# Altium schematic sheet EE209_Schematic.SchDoc
size A4; SheetNumber: 1; SheetTotal: 1
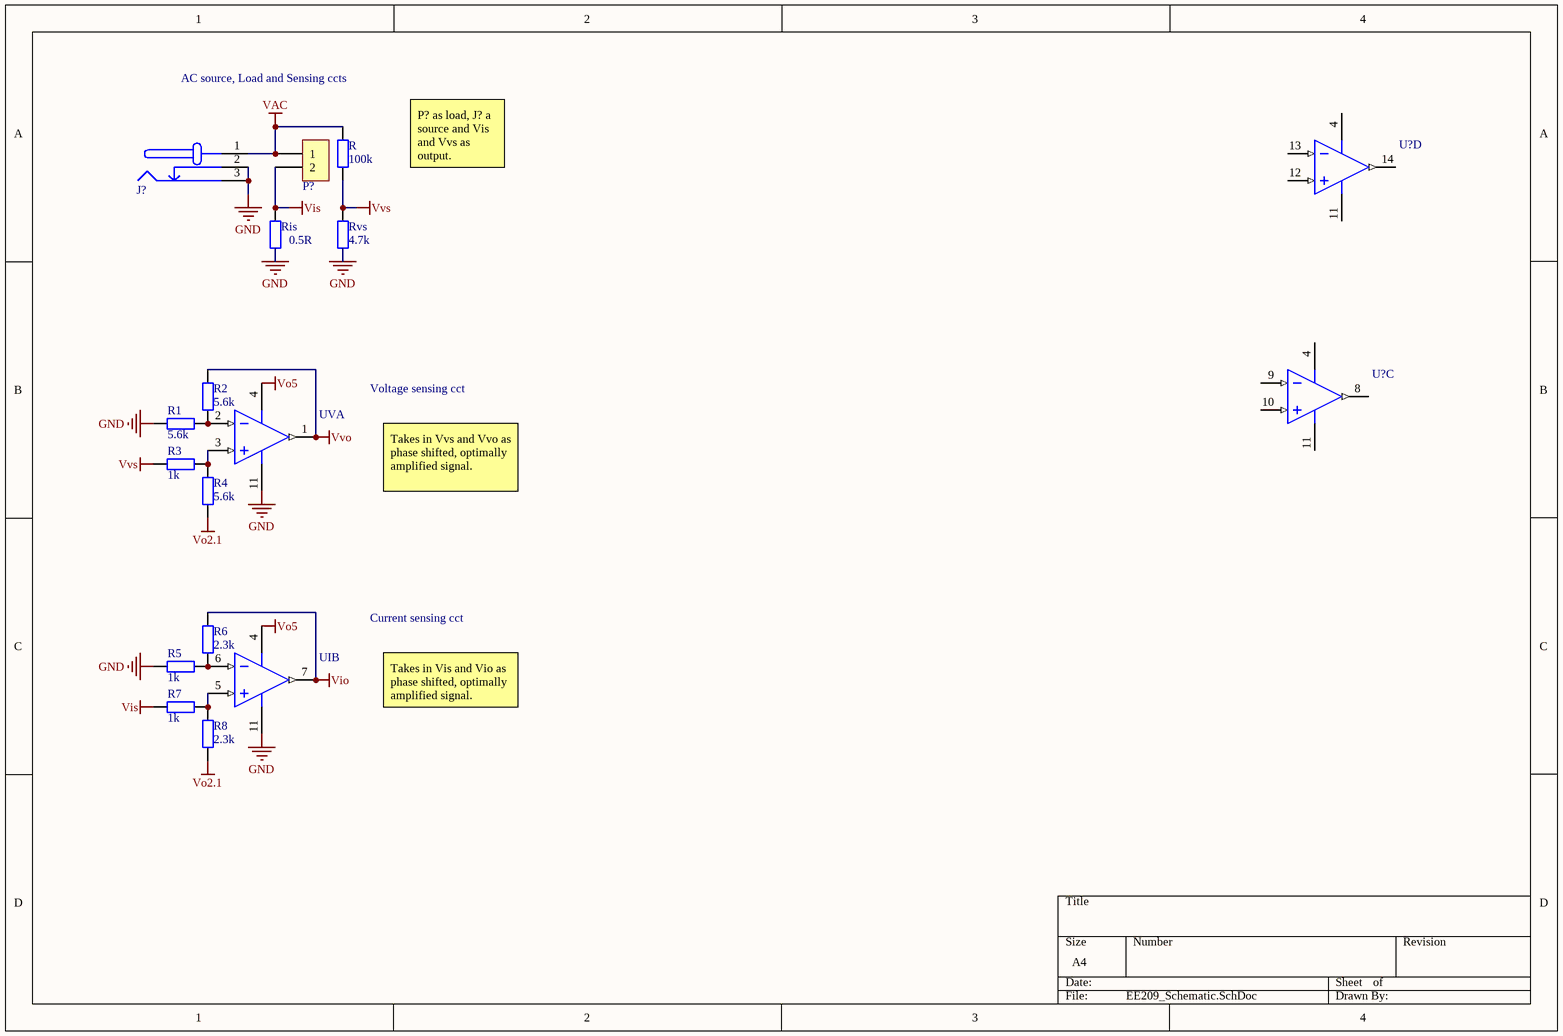
[diagram p0: EE209_Schematic.SchDoc]

## Parts
(Parts that share a designator on the sheet are numbered #1, #2 ... from top to bottom, then left to right.)
J?  DC barrel jack  [AC-Socket]  (value not drawn)
P?  Dual Banana Plugs  [Dual Banana Plug]  (value not drawn)
R  100k  [AXIAL-0.4]
R1  5.6k  [AXIAL-0.4]
R2  5.6k  [AXIAL-0.4]
R3  1k  [AXIAL-0.4]
R4  5.6k  [AXIAL-0.4]
R5  1k  [AXIAL-0.4]
R6  2.3k  [AXIAL-0.4]
R7  1k  [AXIAL-0.4]
R8  2.3k  [AXIAL-0.4]
Ris  0.5R  [AXIAL-0.4]
Rvs  4.7k  [AXIAL-0.4]
U?#1  LM324  [DIP-14]  (value not drawn)  (part D of 4)
U?#2  LM324  [DIP-14]  (value not drawn)  (part C of 4)
UI  LM324  [DIP-14]  (value not drawn)  (part B of 4)
UV  LM324  [DIP-14]  (value not drawn)  (part A of 4)

## Nets
GND: J?.2(GND_ALT) J?.3(GND) R1.1 R5.1 Ris.1 Rvs.1 UI.11(VSS) UV.11(VSS)
VAC: J?.1(VCC) P?.1 R.2
Vio: R6.2 UI.7(VOUTB)
Vis: P?.2 R7.1 Ris.2
Vo2.1: R4.1 R8.2
Vo5: UI.4(VDD) UV.4(VDD)
Vvo: R2.1 UV.1(VOUTA)
Vvs: R.1 R3.1 Rvs.2
NetR1_2: R1.2 R2.2 UV.2(VINA-)
NetR3_2: R3.2 R4.2 UV.3(VINA+)
NetR5_2: R5.2 R6.1 UI.6(VINB-)
NetR7_2: R7.2 R8.1 UI.5(VINB+)

Not connected (* = marked no-connect by the designer): U?#1 4(VDD) 11(VSS) 12(VIND+) 13(VIND-) 14(VOUTD); U?#2 4(VDD) 8(VOUTC) 9(VINC-) 10(VINC+) 11(VSS)

## Notes on the sheet
- AC source, Load and Sensing ccts
- P? as load, J? a source and Vis and Vvs as output.
- Voltage sensing cct
- Takes in Vvs and Vvo as phase shifted, optimally amplified signal.
- Current sensing cct
- Takes in Vis and Vio as phase shifted, optimally amplified signal.

## Library data of the parts
J? = AC_Input: DC barrel jack connection to AC source; Value: socket
P? = AC_Output: Dual banana plugs connection to the AC load; LatestRevisionDate: 17-Jul-2002; LatestRevisionNote: Re-released for DXP Platform.; Publisher: Altium Limited
R R1-R8 Ris Rvs = Res_TH_0AX4: Through hole resistor; Published: 8-Jun-2000; LatestRevisionDate: 17-Jul-2002; LatestRevisionNote: Re-released for DXP Platform.; PackageReference: AXIAL-0.4; Publisher: Altium Limited; ComponentLink1Description: http://www.royalohm.com/pdf/product2017/PrecisionMetalMF.pdf
  R: Value: 100k
  R1 R2 R4: Value: 5.6k
  R3 R5 R7: Value: 1k
  R6 R8: Value: 2.3k
  Ris: Value: 0.5R
  Rvs: Value: 4.7k
U?#1 U?#2 UI UV = LM324N_TH_DIP16: IC OPAMP GP 14DIP; Manufacturer: ON Semiconductor; Manufacturer Part Number: LM324N; Amplifier Type: General Purpose; Current - Supply: 1mA; Voltage - Supply, Single/Dual (±): 3 V ~ 32 V, ±1.5 V ~ 16 V; Supplier 1: Digi-Key; RoHS: RoHS Compliant; Category: Integrated Circuits (ICs); Stock 1: 2900; Pricing 1: 1=0.9, 10=0.775, 100=0.5789, 500=0.45482, 1000=0.35145 (NZD); Packaging: Tube; Part Status: Active; Output Type: -; Slew Rate: -; Operating Temperature: 0°C ~ 70°C; Mounting Type: Through Hole; Package / Case: 14-DIP (0.300", 7.62mm); Supplier Device Package: 14-DIP; Base Part Number: LM324; ComponentLink1URL: https://www.fairchildsemi.com/datasheets/LM/LM2902.pdf; ComponentLink1Description: https://www.fairchildsemi.com/datasheets/LM/LM2902.pdf; Supplier Part Number 1: LM324NFS-ND